# EAGLE schematic pic16f877a_de (EAGLE 9.6.2)
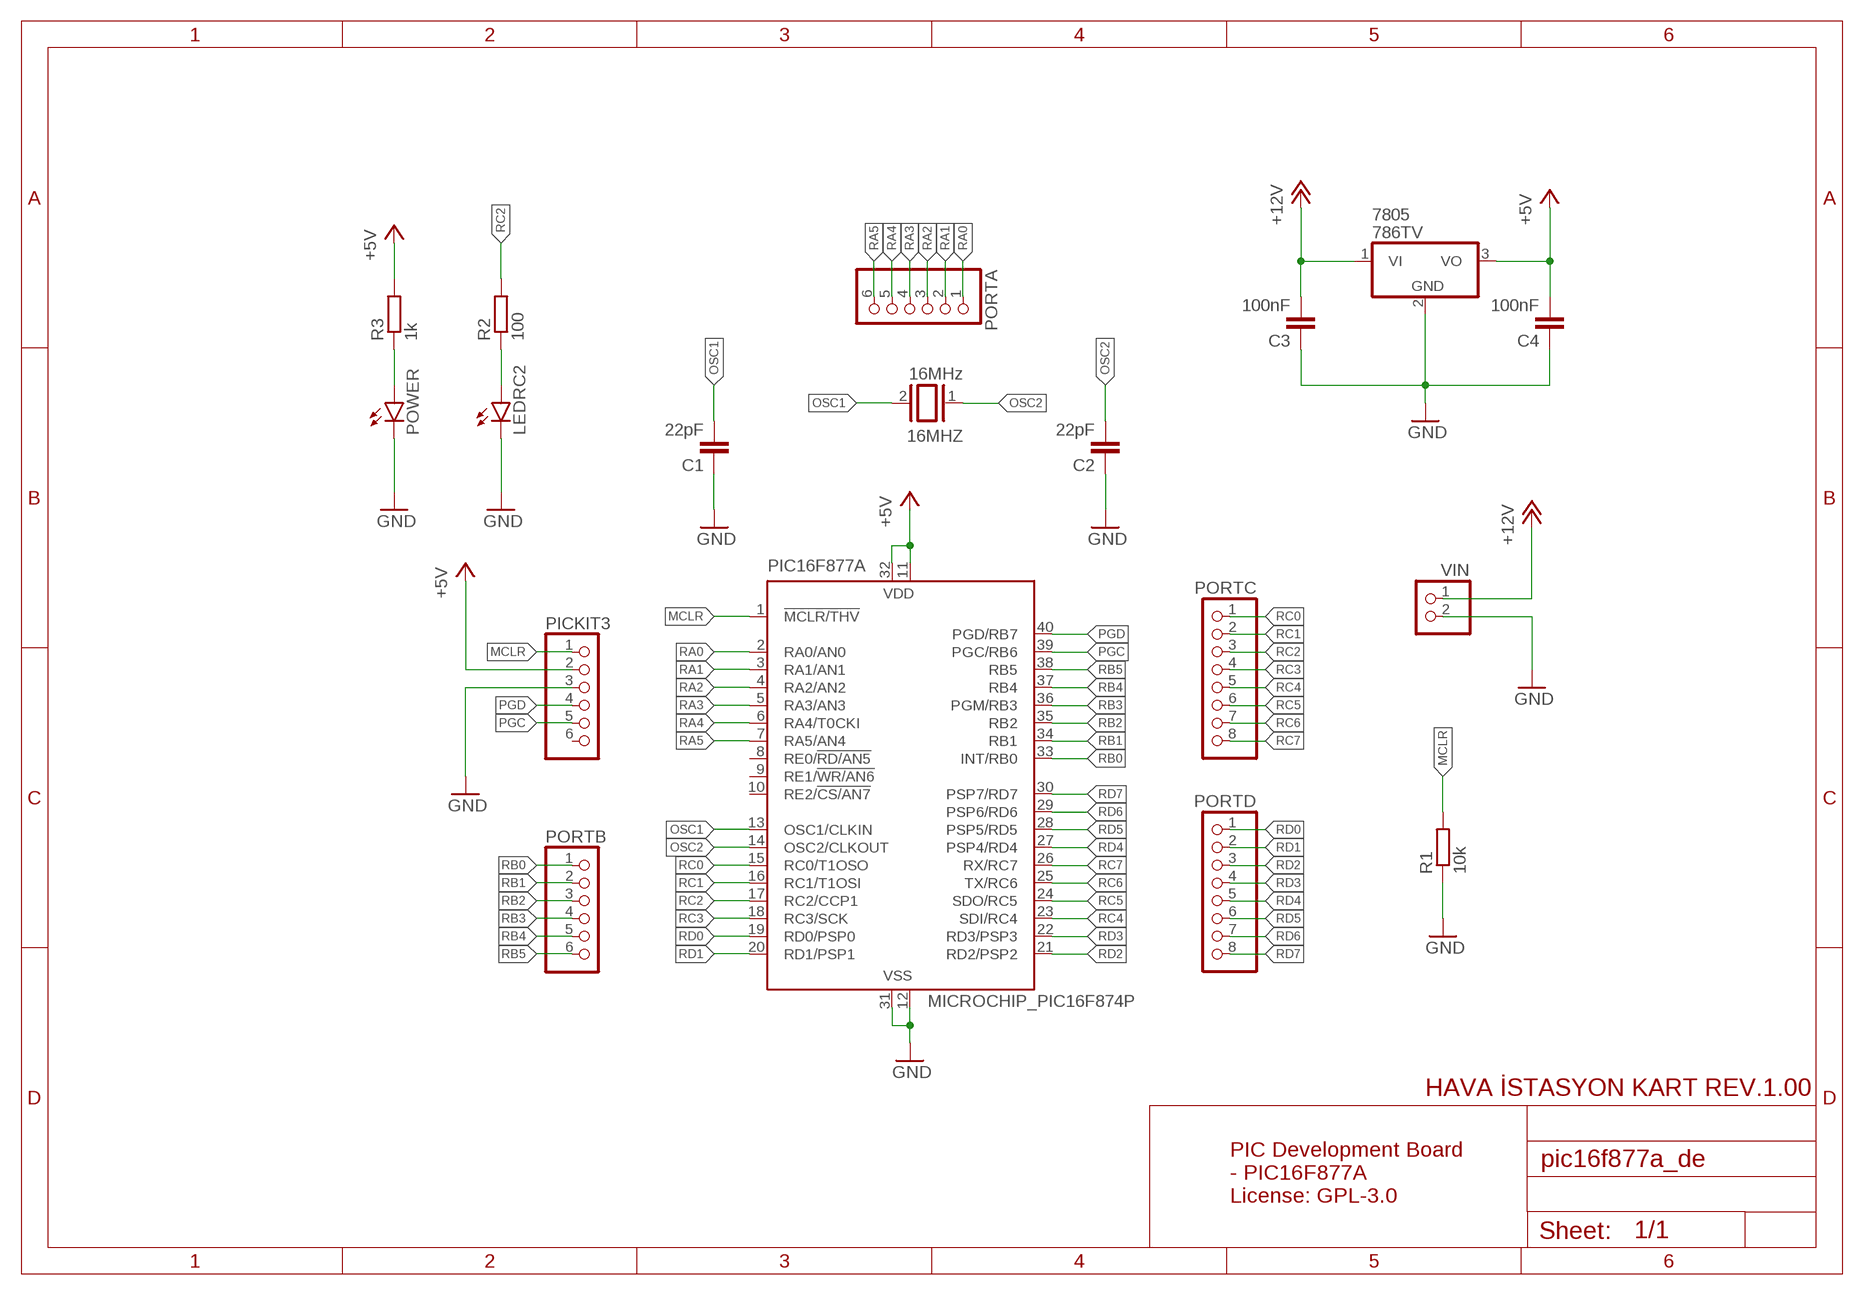
[diagram p0: schematic, sheet 1]

## Parts
16MHZ  16MHz  XTAL/S  [QS]
7805  786TV  [TO220V]
C1  22pF  C-EU025-025X050  [C025-025X050]
C2  22pF  C-EU025-025X050  [C025-025X050]
C3  100nF  C-EU025-025X050  [C025-025X050]
C4  100nF  C-EU025-025X050  [C025-025X050]
LEDRC2  LED5MM  [LED5MM]
PIC16F877A  MICROCHIP_PIC16F874P  [MICROCHIP_DIL40]
PICKIT3  PINHD-1X6  [1X06]
PORTA  PINHD-1X6  [1X06]
PORTB  PINHD-1X6  [1X06]
PORTC  PINHD-1X8  [1X08]
PORTD  PINHD-1X8  [1X08]
POWER  LED5MM  [LED5MM]
R1  10k  R-EU_0207/7  [0207/7]
R2  100  R-EU_0207/7  [0207/7]
R3  1k  R-EU_0207/7  [0207/7]
VIN  PINHD-1X2  [1X02]

## Nets
+5V: 7805.3(VO) C4.2 PIC16F877A.11(VDD) PIC16F877A.32(VDD) PICKIT3.2 R3.2
+12V: 7805.1(VI) C3.2 VIN.1
GND: 7805.2(GND) C1.1 C2.1 C3.1 C4.1 LEDRC2.K(C) PIC16F877A.12(VSS) PIC16F877A.31(VSS) PICKIT3.3 POWER.K(C) R1.1 VIN.2
MCLR: PIC16F877A.1(!MCLR/THV) PICKIT3.1 R1.2
N$1: POWER.A R3.1
N$2: LEDRC2.A R2.1
OSC1: 16MHZ.2 C1.2 PIC16F877A.13(OSC1/CLKIN)
OSC2: 16MHZ.1 C2.2 PIC16F877A.14(OSC2/CLKOUT)
PGC: PIC16F877A.39(PGC/RB6) PICKIT3.5
PGD: PIC16F877A.40(PGD/RB7) PICKIT3.4
RA0: PIC16F877A.2(RA0/AN0) PORTA.1
RA1: PIC16F877A.3(RA1/AN1) PORTA.2
RA2: PIC16F877A.4(RA2/AN2) PORTA.3
RA3: PIC16F877A.5(RA3/AN3) PORTA.4
RA4: PIC16F877A.6(RA4/T0CKI) PORTA.5
RA5: PIC16F877A.7(RA5/AN4) PORTA.6
RB0: PIC16F877A.33(INT/RB0) PORTB.1
RB1: PIC16F877A.34(RB1) PORTB.2
RB2: PIC16F877A.35(RB2) PORTB.3
RB3: PIC16F877A.36(PGM/RB3) PORTB.4
RB4: PIC16F877A.37(RB4) PORTB.5
RB5: PIC16F877A.38(RB5) PORTB.6
RC0: PIC16F877A.15(RC0/T1OSO) PORTC.1
RC1: PIC16F877A.16(RC1/T1OSI) PORTC.2
RC2: PIC16F877A.17(RC2/CCP1) PORTC.3 R2.2
RC3: PIC16F877A.18(RC3/SCK) PORTC.4
RC4: PIC16F877A.23(SDI/RC4) PORTC.5
RC5: PIC16F877A.24(SDO/RC5) PORTC.6
RC6: PIC16F877A.25(TX/RC6) PORTC.7
RC7: PIC16F877A.26(RX/RC7) PORTC.8
RD0: PIC16F877A.19(RD0/PSP0) PORTD.1
RD1: PIC16F877A.20(RD1/PSP1) PORTD.2
RD2: PIC16F877A.21(RD2/PSP2) PORTD.3
RD3: PIC16F877A.22(RD3/PSP3) PORTD.4
RD4: PIC16F877A.27(PSP4/RD4) PORTD.5
RD5: PIC16F877A.28(PSP5/RD5) PORTD.6
RD6: PIC16F877A.29(PSP6/RD6) PORTD.7
RD7: PIC16F877A.30(PSP7/RD7) PORTD.8
Unconnected: PIC16F877A.8(RE0/!RD/AN5) PIC16F877A.9(RE1/!WR/AN6) PIC16F877A.10(RE2/!CS/AN7) PICKIT3.6

## Notes on the sheet
- HAVA İSTASYON KART REV.1.00
- PIC Development Board
  - PIC16F877A
  License: GPL-3.0

## Library data of the parts
16MHZ = special:XTAL/S: CRYSTAL
7805 = linear:78*: Positive VOLTAGE REGULATOR Source: http://cache.national.com/ds/LM/LM78L05.pdf http://www.fairchildsemi.com/ds/LM/LM7805.pdf
C1-C4 = rcl:C-EU: CAPACITOR, European symbol; SPICEPREFIX: C
LEDRC2 POWER = led:LED: LED OSRAM: - CHIPLED LG R971, LG N971, LY N971, LG Q971, LY Q971, LO R971, LY R971 LH N974, LH R974 LS Q976, LO Q976, LY Q976 LO Q996 - Hyper CHIPLED LW Q18S LB Q993, LB Q99A, LB R99A - SideLED LS A670, LO A670, LY A670, LG A670, LP A670 LB A673, LV A673, LT A673, LW A673 LH A674 LY A675 LS A676, LA A676, LO A676, LY A676, LW A676 LS A679, LY A679, LG A679 - Hyper Micro SIDELED® LS Y876, LA Y876, LO Y876, LY Y876 LT Y87S - SmartLED LW L88C, LW L88S LB L89C, LB L89S, LG L890 LS L89K, LO L89K, LY L89K LS L896, LA L896, LO L896, LY L896 - TOPLED LS T670, LO T670, LY T670, LG T670, LP T670 LSG T670, LSP T670, LSY T670, LOP T670, LYG T670 LG T671, LOG T671, LSG T671 LB T673, LV T673, LT T673, LW T673 LH T674 LS T676, LA T676, LO T676, LY T676, LB T676, LH T676, LSB T676, LW T676 LB T67C, LV T67C, LT T67C, LS T67K, LO T67K, LY T67K, LW E67C LS E67B, LA E67B, LO E67B, LY E67B, LB E67C, LV E67C, LT E67C LW T67C LS T679, LY T679, LG T679 LS T770, LO T770, LY T770, LG T770, LP T770 LB T773, LV T773, LT T773, LW T773 LH T774 LS E675, LA E675, LY E675, LS T675 LS T776, LA T776, LO T776, LY T776, LB T776 LHGB T686 LT T68C, LB T68C - Hyper Mini TOPLED® LB M676 - Mini TOPLED Santana® LG M470 LS M47K, LO M47K, LY M47K Source: http://www.osram.convergy.de LUXEON: - LUMILED® LXK2-PW12-R00, LXK2-PW12-S00, LXK2-PW14-U00, LXK2-PW14-V00 LXK2-PM12-R00, LXK2-PM12-S00, LXK2-PM14-U00 LXK2-PE12-Q00, LXK2-PE12-R00, LXK2-PE12-S00, LXK2-PE14-T00, LXK2-PE14-U00 LXK2-PB12-K00, LXK2-PB12-L00, LXK2-PB12-M00, LXK2-PB14-N00, LXK2-PB14-P00, LXK2-PB14-Q00 LXK2-PR12-L00, LXK2-PR12-M00, LXK2-PR14-Q00, LXK2-PR14-R00 LXK2-PD12-Q00, LXK2-PD12-R00, LXK2-PD12-S00 LXK2-PH12-R00, LXK2-PH12-S00 LXK2-PL12-P00, LXK2-PL12-Q00, LXK2-PL12-R00 Source: www.luxeon.com KINGBRIGHT: KA-3528ASYC Source: www.kingbright.com
PIC16F877A = pic16f877a:MICROCHIP_PIC16F87*: MICROCONTROLLER; MPN: PIC16F874-04I/P; OC_FARNELL: 1196797; OC_NEWARK: 24M5903
PICKIT3 PORTA PORTB = pinhead:PINHD-1X6: PIN HEADER
PORTC PORTD = pinhead:PINHD-1X8: PIN HEADER
R1-R3 = rcl:R-EU_: RESISTOR, European symbol; SPICEPREFIX: R
VIN = pinhead:PINHD-1X2: PIN HEADER